# EAGLE design OSO-MISC-20-014A Neopixel for Spike (EAGLE 9.4.2)
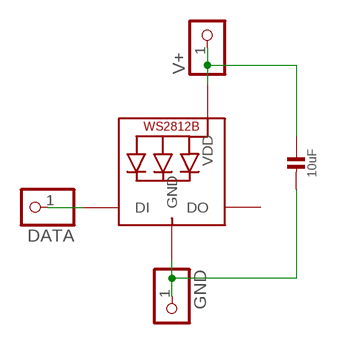
[diagram p0: schematic, sheet 1]

## Parts
C1  10uF  CAP_CERAMIC0805-NOOUTLINE  [0805-NO]
DATA  PINHD-1X1  [1X01]
GND  PINHD-1X1  [1X01]
LED1  WS2812B3535  [LED3535]
V+  PINHD-1X1  [1X01]

## Nets
N$1: DATA.1 LED1.1(DI)
N$2: C1.1 LED1.2(VDD) V+.1
N$3: C1.2 GND.1 LED1.4(GND)
Unconnected: LED1.3(DO)

## Library data of the parts
C1 = microbuilder:CAP_CERAMIC: Ceramic Capacitors For new designs, use the packages preceded by an '_' character since they are more reliable: The following footprints should be used on most boards: _0402 - Standard footprint for regular board layouts _0603 - Standard footprint for regular board layouts _0805 - Standard footprint for regular board layouts _1206 - Standard footprint for regular board layouts For extremely tight-pitch boards where space is at a premium, the following 'micro-pitch' footprints can be used (smaller pads, no silkscreen outline, etc.): _0402MP - Micro-pitch footprint for very dense/compact boards _0603MP - Micro-pitch footprint for very dense/compact boards _0805MP - Micro-pitch footprint for very dense/compact boards _1206MP - Micro-pitch footprint for very dense/compact boards
DATA GND V+ = pinhead-round:PINHD-1X1: PIN HEADER
LED1 = adafruit:WS2812B

## Board
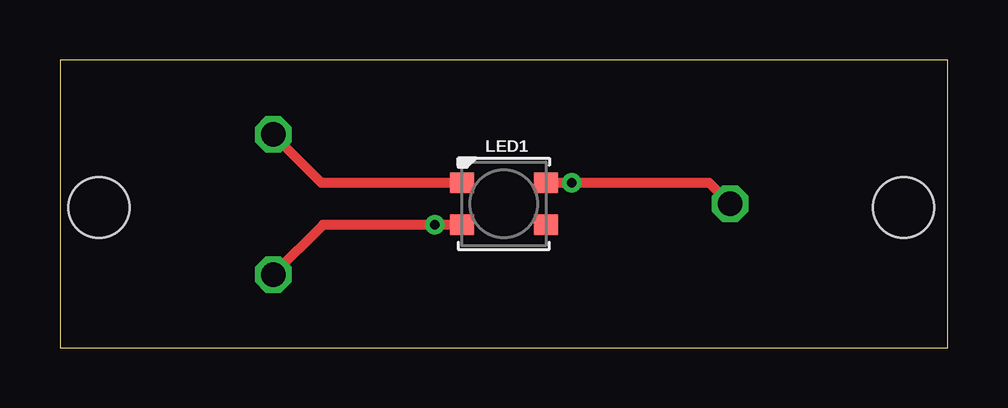
[diagram p1: board, top side]
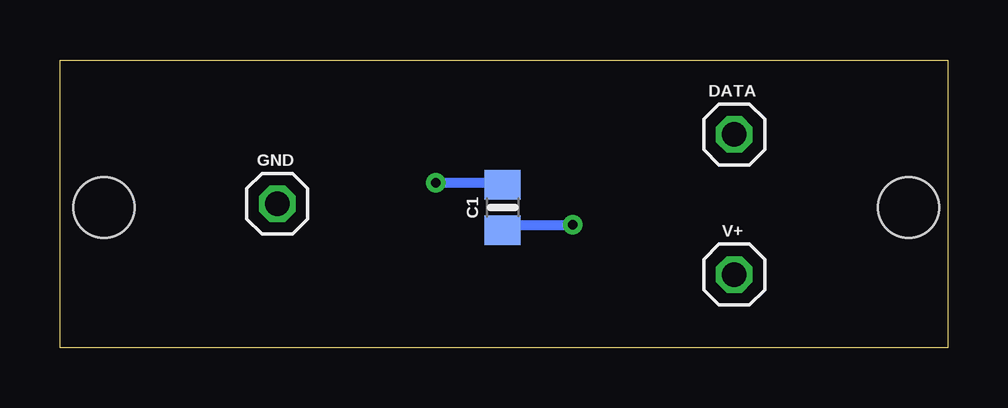
[diagram p2: board, bottom side, seen from below]

Size 37 x 12 mm. Coordinates in mm from the lower left corner, seen from the top.
Outline: 0,0 37,0 37,12 0,12 0,0
Copper layers (1*16): Top 0.035mm / dielectric 1.5mm / Bottom 0.035mm
Design rules "default *": minimum track width 6mil, minimum drill 0.35mm, track to track 6mil, track to pad 6mil, pad to pad 6mil, via to via 6mil, smd to smd 6mil, copper to edge 40mil, drill to drill 6mil, minimum pad ring 10mil, minimum via ring 8mil, stop-mask expansion 4mil, vias tented up to drill 16mil, thermal gap 10mil
Holes 2.54 mm at 1.62,5.84 35.17,5.84

### Footprints (pad centres in the part's own frame; a part is rotated, then mirrored left to right if it is on the bottom)
0805-NO = smd 1.24 x 1.5: 1 -0.95,0; 2 0.95,0
1X01 = drill 1.016 octagon: 1 0,0
LED3535 = smd 1 x 0.85: 1 -1.75,0.875; 2 -1.75,-0.875; 3 1.75,-0.875; 4 1.75,0.875

### Placement (x,y rotation side)
C1  18.54,5.84 90 bottom
DATA  8.89,8.89 0 bottom
GND  27.94,6 0 bottom
LED1  18.5,6 0 top
V+  8.89,3.05 0 bottom

### Tracks (layer width: path | path; a pad name or v marks a point on that pad's centre or on a via)
N$1
  Top 0.406: LED1.1 10.9,6.88 DATA.1
N$2  (via drill 0.41)
  Top 0.406: LED1.2 v15.62,5.12 10.97,5.12 V+.1
  Bottom 0.406: C1.1 18.31,5.12 v15.62,5.12
N$3  (via drill 0.41)
  Top 0.406: LED1.4 v21.34,6.88 27.07,6.88 GND.1
  Bottom 0.406: C1.2 18.62,6.88 v21.34,6.88